# Altium schematic sheet LevelShiftADC.SchDoc
size A4
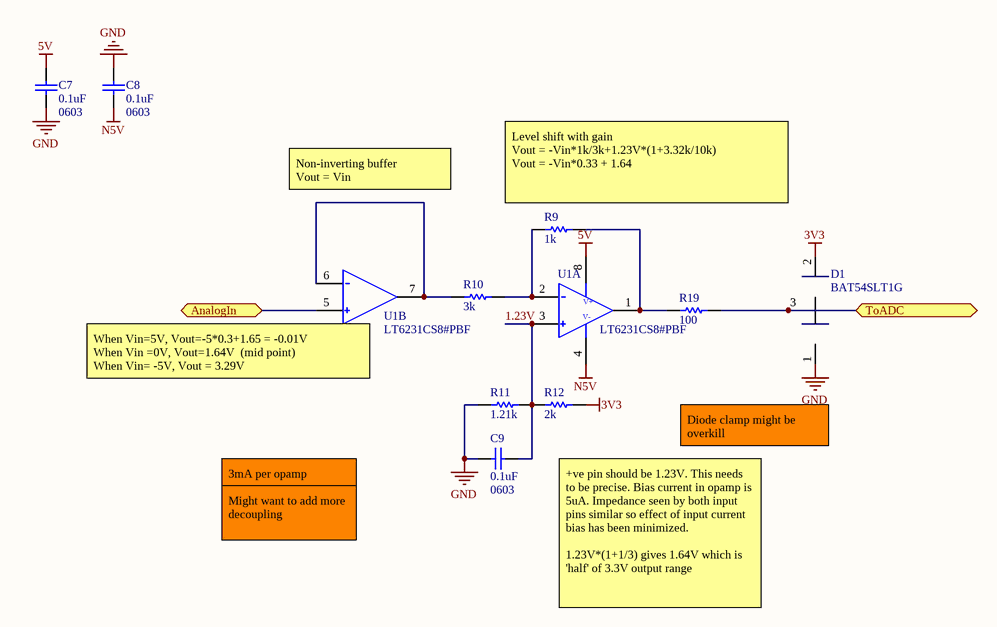
[diagram p0: LevelShiftADC.SchDoc]

## Parts
C7  0.1uF  [0603]
C8  0.1uF  [0603]
C9  0.1uF  [0603]
D1  BAT54SLT1G  [SOT23]
R9  value 1k  [0603]  (hidden comment: Res0603)
R10  value 3k  [0603]  (hidden comment: Res0603)
R11  value 1.21k  [0603]  (hidden comment: Res0603)
R12  value 2k  [0603]  (hidden comment: Res0603)
R19  value 100  [0603]  (hidden comment: Res0603)
U1  LT6231CS8#PBF  [SO8]  (parts A,B of 2)

## Ports
AnalogIn, ToADC

## Nets
3V3: D1.2 R12.2
5V: C7.2 U1.8(V+)
GND: C7.1 C8.2 C9.1 D1.1 R11.1
N5V: C8.1 U1.4(V-)
1.23V: C9.2 R11.2 R12.1 U1.3(IN+)
AnalogIn: U1.5(IN+) ; port AnalogIn
ToADC: D1.3 R19.2 ; port ToADC
NetR9_1: R9.1 R10.2 U1.2(IN-)
NetR9_2: R9.2 R19.1 U1.1(Out)
NetR10_1: R10.1 U1.6(IN-) U1.7(Out)

## Notes on the sheet
- Non-inverting buffer
  Vout = Vin
- (near R9) Level shift with gain
  Vout = -Vin*1k/3k+1.23V*(1+3.32k/10k)
  Vout = -Vin*0.33 + 1.64
- (near U1) When Vin=5V, Vout=-5*0.3+1.65 = -0.01V
  When Vin =0V, Vout=1.64V  (mid point)
  When Vin= -5V, Vout = 3.29V
- Diode clamp might be overkill
- 3mA per opamp
- Might want to add more decoupling
- +ve pin should be 1.23V. This needs to be precise. Bias current in opamp is 5uA. Impedance seen by both input pins similar so effect of input current bias has been minimized.
  1.23V*(1+1/3) gives 1.64V which is 'half' of 3.3V output range

## Library data of the parts
C7-C9 = Cap0603: Capacitor, Ceramic, 0603; Manufacturer: Samsung Electro-Mechanics; Manufacturers Part Number: CL10A104KA8NNNC; Assembly Comments: none; Loaded: True; Value: 0.1uF 25V; TechInf: *; Param1: *; Part constraints: CL10A104KA8NNNC; Supplier 1: Digi-Key; Supplier Part Number 1: 1276-1857-1-ND; SupplierUnitCost: $0.02092
D1 = DiodeClamp: Manufacturer: ON Semiconductor; Assembly Comments: none; Loaded: True; Manufacturers Part Number: BAT54SLT1G; Part constraints: BAT54SLT1G; Supplier 1: Digi-Key; Supplier Part Number 1: BAT54SLT1GOSCT-ND; SupplierUnitCost: $0.132
R9 = Res0603: Resistor; Manufacturer: Yageo; Manufacturers Part Number: RC0603FR-071KL; Assembly Comments: none; Loaded: True; TechInfo: *; Part constraints: RC0603FR-071KL; Supplier 1: Digi-Key; Supplier Part Number 1: 311-1.00KHRCT-ND; SupplierUnitCost: $0.016
R10 = Res0603: Resistor; Manufacturer: Vishay Dale; Manufacturers Part Number: CRCW06033K00FKEAC; Assembly Comments: none; Loaded: True; TechInfo: *; Part constraints: CRCW06033K00FKEAC; Supplier 1: Digi-Key; Supplier Part Number 1: 541-4040-1-ND; SupplierUnitCost: $0.018
R11 = Res0603: Resistor; Manufacturer: Yageo; Manufacturers Part Number: RMCF0603FT1K21; Assembly Comments: none; Loaded: True; TechInfo: *; Part constraints: RMCF0603FT1K21; Supplier 1: Digi-Key; Supplier Part Number 1: RMCF0603FT1K21CT-ND; SupplierUnitCost: $0.0107
R12 = Res0603: Resistor; Manufacturer: Vishay Dale; Manufacturers Part Number: CRCW06032K00FKEAC; Assembly Comments: none; Loaded: True; TechInfo: *; Part constraints: CRCW06032K00FKEAC; Supplier 1: Digi-Key; Supplier Part Number 1: 541-3953-1-ND; SupplierUnitCost: $0.01180
R19 = Res0603: Resistor; Manufacturer: Yageo; Manufacturers Part Number: RC0603FR-07100RL; Assembly Comments: none; Loaded: True; TechInfo: *; Part constraints: RC0603FR-07100RL; Supplier 1: Digi-Key; Supplier Part Number 1: 311-100HRCT-ND; SupplierUnitCost: $0.016
U1 = TSH82IYDT: Dual R-R Opamp Soic 8 215Mhz GBP; Manufacturer: Linear Technology/Analog Devices; Assembly Comments: none; Loaded: True; Supplier 1: Digi-Key; Supplier Part Number 1: LT6231CS8#PBF-ND; Part Constraints: LT6231CS8; Manufacturers Part Number: LT6231CS8; SupplierUnitCost: $3.5